# Altium schematic sheet Earphone-2.SchDoc
size A4
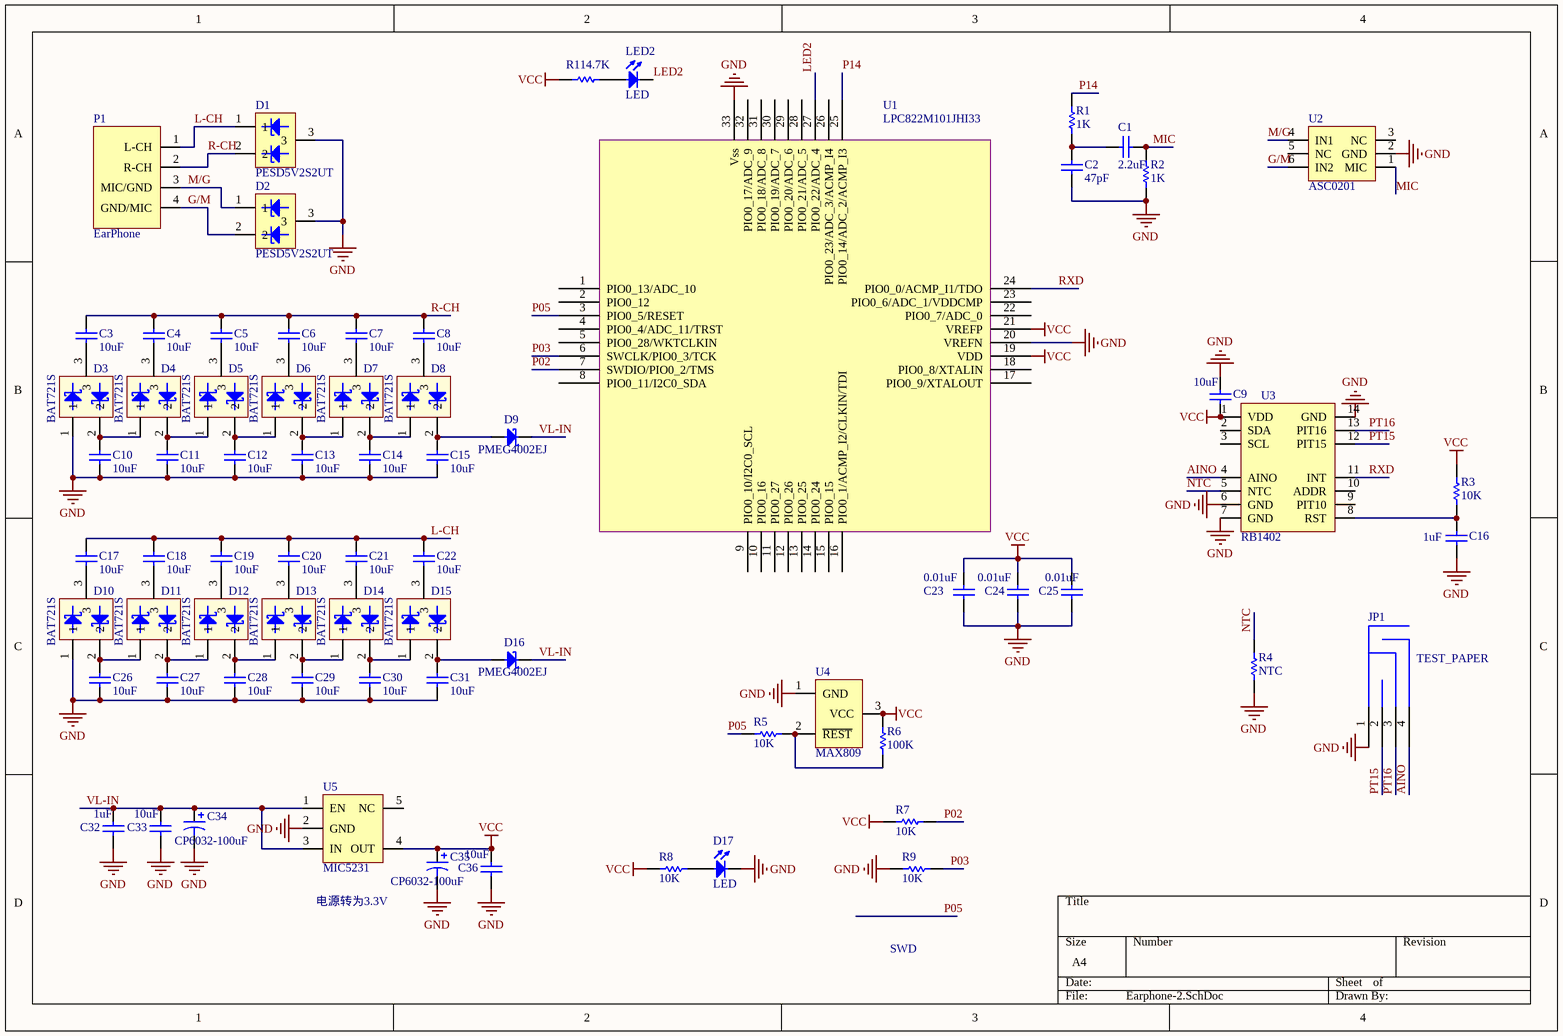
[diagram p0: Earphone-2.SchDoc]

## Parts
C1  2.2uF  [0402C]
C2  47pF  [0402C]
C3  10uF  [0402C]
C4  10uF  [0402C]
C5  10uF  [0402C]
C6  10uF  [0402C]
C7  10uF  [0402C]
C8  10uF  [0402C]
C9  10uF  [0402C]
C10  10uF  [0402C]
C11  10uF  [0402C]
C12  10uF  [0402C]
C13  10uF  [0402C]
C14  10uF  [0402C]
C15  10uF  [0402C]
C16  1uF  [0402C]
C17  10uF  [0402C]
C18  10uF  [0402C]
C19  10uF  [0402C]
C20  10uF  [0402C]
C21  10uF  [0402C]
C22  10uF  [0402C]
C23  0.01uF  [0402C]
C24  0.01uF  [0402C]
C25  0.01uF  [0402C]
C26  10uF  [0402C]
C27  10uF  [0402C]
C28  10uF  [0402C]
C29  10uF  [0402C]
C30  10uF  [0402C]
C31  10uF  [0402C]
C32  1uF  [0402C]
C33  10uF  [0402C]
C34  CP6032-100uF  [T3216-18[A]]
C35  CP6032-100uF  [T3216-18[A]]
C36  10uF  [0402C]
D1  PESD5V2S2UT  [SOT23]
D2  PESD5V2S2UT  [SOT23]
D3  BAT721S  [SOT23]
D4  BAT721S  [SOT23]
D5  BAT721S  [SOT23]
D6  BAT721S  [SOT23]
D7  BAT721S  [SOT23]
D8  BAT721S  [SOT23]
D9  PMEG4002EJ  [SOD323]
D10  BAT721S  [SOT23]
D11  BAT721S  [SOT23]
D12  BAT721S  [SOT23]
D13  BAT721S  [SOT23]
D14  BAT721S  [SOT23]
D15  BAT721S  [SOT23]
D16  PMEG4002EJ  [SOD323]
D17  LED  [0603L]
JP1  TEST_PAPER  [TEST_PAPER]
LED2  LED  [0603L]
P1  EarPhone  [EarPhone]
R1  1K  [0402R]
R2  1K  [0402R]
R3  10K  [0402R]
R4  NTC  [0603R]
R5  10K  [0402R]
R6  100K  [0402R]
R7  10K  [0402R]
R8  10K  [0402R]
R9  10K  [0402R]
R11  4.7K  [0402R]
U1  LPC822M101JHI33  [QFN50P500X500X100-33N]
U2  ASC0201  [SOT23-6]
U3  RB1402  [RB1402]
U4  MAX809  [SOT23]
U5  MIC5231  [SOT23-5]

## Nets
GND: C2.1 C9.2 C10.1 C11.1 C12.1 C13.1 C14.1 C15.1 C16.1 C23.1 C24.1 C25.1 C26.1 C27.1 C28.1 C29.1 C30.1 C31.1 C32.1 C33.1 C34.2 C35.2 C36.1 D1.3 D2.3 D3.1 D10.1 D17.2(K) JP1.1(N) R2.2 R4.1 R9.2 U1.20(VREFN) U1.33(Vss) U2.2(GND) U3.6(GND) U3.7(GND) U3.14(GND) U4.1(GND) U5.2(GND)
VCC: C9.1 C23.2 C24.2 C25.2 C35.1 C36.2 R3.2 R6.2 R7.1 R8.1 R11.1 U1.19(VDD) U1.21(VREFP) U3.1(VDD) U4.3(VCC) U5.4(OUT)
AINO: JP1.4(P) U3.4(AINO)
G/M: D2.2 P1.4(GND/MIC) U2.6(IN2)
L-CH: C17.2 C18.2 C19.2 C20.2 C21.2 C22.2 D1.1 P1.1(L-CH)
LED2: LED2.2(K) U1.27(PIO0_22/ADC_4)
M/G: D2.1 P1.3(MIC/GND) U2.4(IN1)
MIC: C1.1 R2.1 U2.1(MIC)
NTC: R4.2 U3.5(NTC)
P02: R7.2 U1.7(SWDIO/PIO0_2/TMS)
P03: R9.1 U1.6(SWCLK/PIO0_3/TCK)
P05: R5.1 U1.3(PIO0_5/RESET)
P14: R1.1 U1.25(PIO0_14/ADC_2/ACMP_I3)
PT15: JP1.2(PC10) U3.12(PIT15)
PT16: JP1.3(NOP) U3.13(PIT16)
R-CH: C3.2 C4.2 C5.2 C6.2 C7.2 C8.2 D1.2 P1.2(R-CH)
RXD: U1.24(PIO0_0/ACMP_I1/TDO) U3.11(INT)
VL-IN: C32.2 C33.2 C34.1 D9.1 D16.1 U5.1(EN) U5.3(IN)
NetC1_2: C1.2 C2.2 R1.2
NetC3_1: C3.1 D3.3
NetC4_1: C4.1 D4.3
NetC5_1: C5.1 D5.3
NetC6_1: C6.1 D6.3
NetC7_1: C7.1 D7.3
NetC8_1: C8.1 D8.3
NetC10_2: C10.2 D3.2 D4.1
NetC11_2: C11.2 D4.2 D5.1
NetC12_2: C12.2 D5.2 D6.1
NetC13_2: C13.2 D6.2 D7.1
NetC14_2: C14.2 D7.2 D8.1
NetC15_2: C15.2 D8.2 D9.2
NetC16_2: C16.2 R3.1 U3.8(RST)
NetC17_1: C17.1 D10.3
NetC18_1: C18.1 D11.3
NetC19_1: C19.1 D12.3
NetC20_1: C20.1 D13.3
NetC21_1: C21.1 D14.3
NetC22_1: C22.1 D15.3
NetC26_2: C26.2 D10.2 D11.1
NetC27_2: C27.2 D11.2 D12.1
NetC28_2: C28.2 D12.2 D13.1
NetC29_2: C29.2 D13.2 D14.1
NetC30_2: C30.2 D14.2 D15.1
NetC31_2: C31.2 D15.2 D16.2
NetD17_1: D17.1(A) R8.2
NetLED2_1: LED2.1(A) R11.2
NetR5_2: R5.2 R6.1 U4.2(~{REST})

Not connected (* = marked no-connect by the designer): U1 1(PIO0_13/ADC_10) 2(PIO0_12) 4(PIO0_4/ADC_11/TRST) 5(PIO0_28/WKTCLKIN) 8(PIO0_11/I2C0_SDA) 9(PIO0_10/I2C0_SCL) 10(PIO0_16) 11(PIO0_27) 12(PIO0_26) 13(PIO0_25) 14(PIO0_24) 15(PIO0_15) 16(PIO0_1/ACMP_I2/CLKIN/TDI) 17(PIO0_9/XTALOUT) 18(PIO0_8/XTALIN) 22(PIO0_7/ADC_0) 23(PIO0_6/ADC_1/VDDCMP) 26(PIO0_23/ADC_3/ACMP_I4) 28(PIO0_21/ADC_5) 29(PIO0_20/ADC_6) 30(PIO0_19/ADC_7) 31(PIO0_18/ADC_8) 32(PIO0_17/ADC_9); U2 3(NC) 5(NC); U3 2(SDA) 3(SCL) 9(PIT10) 10(ADDR); U5 5(NC)

## Notes on the sheet
- (near U5) 电源转为3.3V
- SWD

## Library data of the parts
C1-C33 C36 = CAP
C34 C35 = CAP POL2
D1 D2 = PESD5V2S2UT: SOT23
D3-D8 D10-D15 = BAT721S: SOT23
D9 D16 = PMEG4002EJ: SOD323F
R1-R9 R11 = RES
U2 = ASC0201: SOT23-6
U4 = MAX809: SOT23